# EAGLE design SparkFun_Buck-Boost (EAGLE 9.6.2)
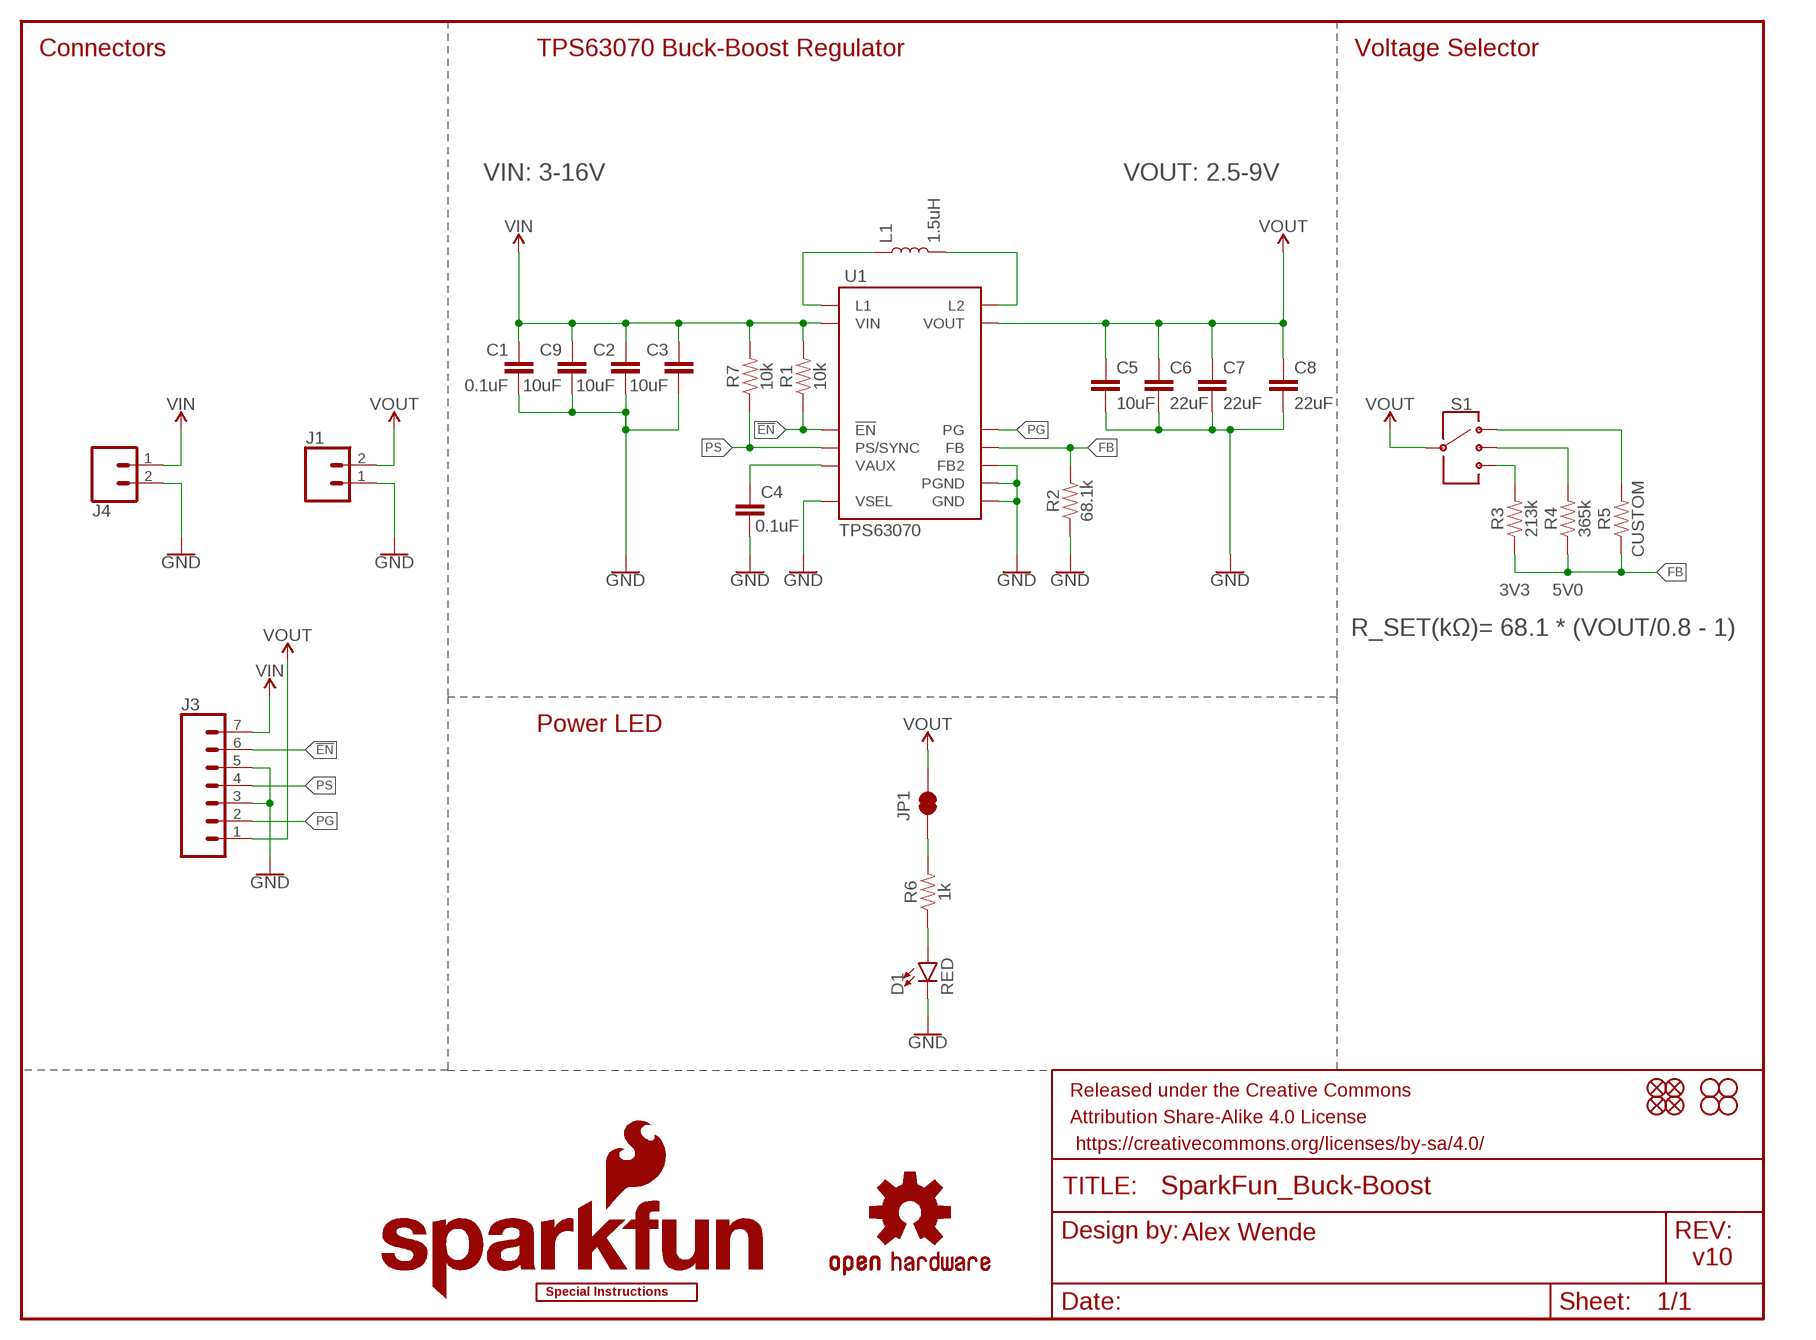
[diagram p0: schematic, sheet 1]

## Parts
C1  0.1uF  0.1UF-0603-25V-(+80/-20%)  [0603]
C2  10uF  10UF-0805-25V-10%  [0805]
C3  10uF  10UF-0805-25V-10%  [0805]
C4  0.1uF  0.1UF-0603-25V-(+80/-20%)  [0603]
C5  10uF  10UF-0805-25V-10%  [0805]
C6  22uF  22UF-0805-16V-20%  [0805]
C7  22uF  22UF-0805-16V-20%  [0805]
C8  22uF  22UF-0805-16V-20%  [0805]
C9  10uF  10UF-0805-25V-10%  [0805]
D1  RED  LED-RED0603  [LED-0603]
FD1  FIDUCIALUFIDUCIAL  [FIDUCIAL-MICRO]
FD2  FIDUCIALUFIDUCIAL  [FIDUCIAL-MICRO]
FD3  FIDUCIALUFIDUCIAL  [FIDUCIAL-MICRO]
FD4  FIDUCIALUFIDUCIAL  [FIDUCIAL-MICRO]
FRAME1  FRAME-LETTER  [CREATIVE_COMMONS]
H1  STAND-OFF  [STAND-OFF]
H2  STAND-OFF  [STAND-OFF]
H3  STAND-OFF  [STAND-OFF]
H4  STAND-OFF  [STAND-OFF]
J1  CONN_023.5MM-NO_SILK  [SCREWTERMINAL-3.5MM-2-NS]
J3  CONN_07NO_SILK  [1X07_NO_SILK]
J4  CONN_023.5MM-NO_SILK  [SCREWTERMINAL-3.5MM-2-NS]
JP1  JUMPER-SMT_2_NC_TRACE_NO-SILK  [SMT-JUMPER_2_NC_TRACE_NO-SILK]
L1  1.5uH  INDUCTOR-XFL40201.5UH  [XFL4020]
LOGO1  SFE_LOGO_NAME_FLAME.1_INCH  [SFE_LOGO_NAME_FLAME_.1]
LOGO2  OSHW-LOGOS  [OSHW-LOGO-S]
LOGO3  SPECIAL_INSTRUCTIONS-ORDERING  [ORDERING_INSTRUCTIONS]
R1  10k  10KOHM-0603-1/10W-1%  [0603]
R2  68.1k  68.1KOHM-0603-1/10W-1%  [0603]
R3  213k  213KOHM-0603-1/10W-0.1%  [0603]
R4  365k  365KOHM-0603-1/10W-1%  [0603]
R5  CUSTOM  RESISTORAXIAL-0.3  [AXIAL-0.3]
R6  1k  1KOHM-0603-1/10W-1%  [0603]
R7  10k  10KOHM-0603-1/10W-1%  [0603]
S1  SWITCH-SP3T-SMD  [SWITCH_SP3T_SMD]
U1  TPS63070  [VQFN-15-HR(3X2.5)]

## Nets
!EN: J3.6 R1.1 U1.P$14(!EN)
FB: R2.2 R3.1 R4.1 R5.P$1 U1.P$5(FB)
GND: C1.2 C2.2 C3.2 C4.2 C5.2 C6.2 C7.2 C8.2 C9.2 D1.C J1.1 J3.3 J3.5 J4.2 R2.1 U1.P$4(GND) U1.P$6(FB2) U1.P$10(PGND) U1.P$15(VSEL)
N$1: L1.P$1 U1.P$11(L1)
N$2: L1.P$2 U1.P$9(L2)
N$4: R5.P$2 S1.1
N$5: R4.2 S1.2
N$6: C4.1 U1.P$3(VAUX)
N$7: R3.2 S1.4
N$8: JP1.1 R6.2
N$9: D1.A R6.1
PG: J3.2 U1.P$2(PG)
PS: J3.4 R7.1 U1.P$1(PS/SYNC)
VIN: C1.1 C2.1 C3.1 C9.1 J3.7 J4.1 R1.2 R7.2 U1.P$12/13(VIN)
VOUT: C5.1 C6.1 C7.1 C8.1 J1.2 J3.1 JP1.2 S1.3 U1.P$7/8(VOUT)

## Notes on the sheet
- Connectors | TPS63070 Buck-Boost Regulator | Voltage Selector
- VIN: 3-16V | VOUT: 2.5-9V
- 3V3 | 5V0
- R_SET(kΩ)= 68.1 * (VOUT/0.8 - 1)
- Power LED
- Alex Wende
- v10

## Library data of the parts
C1 C4 = SparkFun-Capacitors:0.1UF: 0.1µF ceramic capacitors A capacitor is a passive two-terminal electrical component used to store electrical energy temporarily in an electric field.; PROD_ID: CAP-00810
C2 C3 C5 C9 = SparkFun-Capacitors:10UF: 10.0µF ceramic capacitors A capacitor is a passive two-terminal electrical component used to store electrical energy temporarily in an electric field.; PROD_ID: CAP-14259
C6-C8 = SparkFun-Capacitors:22UF: 22µF ceramic capacitors A capacitor is a passive two-terminal electrical component used to store electrical energy temporarily in an electric field.; PROD_ID: CAP-14260
D1 = SparkFun-LED:LED-RED: Red SMD LED Used in manufacturing of most products at SparkFun Packages: 0603 - SMD 0603 package [Product Link] <http://docs.avagotech.com/docs/AV02-0551EN> 0603 SMART - SMD 0603 SMART package ( more efficient and expensive)[Product Link] <http://www.osram-os.com/Graphics/XPic2/00077099_0.pdf> 1206 - SMD1206 package [Product Link] <https://www.sparkfun.com/datasheets/DevTools/LilyPad/Q150OVS4.pdff> SparkFun Products: Pro Mini 328 -5V <https://www.sparkfun.com/products/821> RedBoard <https://www.sparkfun.com/products/12757> IOIO-OTG <https://www.sparkfun.com/products/13613>; PROD_ID: DIO-00819
FD1-FD4 = SparkFun-Aesthetics:FIDUCIAL: Fiducial Alignment Points Point-of-reference for pick-and-place machines and other optical instruments.
FRAME1 = SparkFun-Aesthetics:FRAME-LETTER: Schematic Frame - Letter Standard 8.5x11 US Letter frame
H1-H4 = SparkFun-Hardware:STAND-OFF: Stand Off Drill holes for mechanically mounting via screws, standoffs, etc. Note: Use the keepout ring to avoid running the screw head into surrounding components. Variant Overviews STAND-OFF - Mechanical footprint for a #4 phillips button head screw. STAND-OFF-TIGHT - Mechanical footprint for a #4 phillips button head screw, Example SparkFun Products Screw - Phillips Head (1/4", 4-40, 10 pack) <https://www.sparkfun.com/products/10453> (PRT-10453) Screw - Phillips Head (1/2", 4-40, 10 pack) <https://www.sparkfun.com/products/10452> (PRT-10452) Screw - Phillips Head (3/4", 4-40, 10 pack) <https://www.sparkfun.com/products/10451> (PRT-10451) Screw - Phillips Head (1", 4-40, 10 pack) <https://www.sparkfun.com/products/10450> (PRT-10450)
J1 J4 = SparkFun-Connectors:CONN_02: Multi connection point. Often used as Generic Header-pin footprint for 0.1 inch spaced/style header connections On any of the 0.1 inch spaced packages, you can populate with these: Break Away Headers - Straight <https://www.sparkfun.com/products/116> (PRT-00116) Break Away Male Headers - Right Angle <https://www.sparkfun.com/products/553> (PRT-00553) Female Headers <https://www.sparkfun.com/products/115> (PRT-00115) Break Away Headers - Machine Pin <https://www.sparkfun.com/products/117> (PRT-00117) Break Away Female Headers - Swiss Machine Pin <https://www.sparkfun.com/products/743> (PRT-00743) For SCREWTERMINALS and SPRING TERMINALS visit here: Screw Terimnals on SparkFun.com <https://www.sparkfun.com/search/results?term=Screw+Terminals> (5mm/3.5mm/2.54mm spacing) This device is also useful as a general connection point to wire up your design to another part of your project. Our various solder wires solder well into these plated through hole pads. Hook-Up Wire - Assortment (Stranded, 22 AWG) <https://www.sparkfun.com/products/11375> (PRT-11375) Hook-Up Wire - Assortment (Solid Core, 22 AWG) <https://www.sparkfun.com/products/11367> (PRT-11367) View the entire wire category on our website here <https://www.sparkfun.com/categories/141> Special notes: Molex polarized connector foot print use with: PRT-08233 with associated crimp pins and housings. 2.54_SCREWTERM for use with PRT-10571. 3.5mm Screw Terminal footprints for PRT-08084 5mm Screw Terminal footprints for use with PRT-08432; PROD_ID: CONN-08399
J3 = SparkFun-Connectors:CONN_07: Multi connection point. Often used as Generic Header-pin footprint for 0.1 inch spaced/style header connections On any of the 0.1 inch spaced packages, you can populate with these: Break Away Headers - Straight <https://www.sparkfun.com/products/116> (PRT-00116) Break Away Male Headers - Right Angle <https://www.sparkfun.com/products/553> (PRT-00553) Female Headers <https://www.sparkfun.com/products/115> (PRT-00115) Break Away Headers - Machine Pin <https://www.sparkfun.com/products/117> (PRT-00117) Break Away Female Headers - Swiss Machine Pin <https://www.sparkfun.com/products/743> (PRT-00743) For SCREWTERMINALS and SPRING TERMINALS visit here: Screw Terimnals on SparkFun.com <https://www.sparkfun.com/search/results?term=Screw+Terminals> (5mm/3.5mm/2.54mm spacing) This device is also useful as a general connection point to wire up your design to another part of your project. Our various solder wires solder well into these plated through hole pads. Hook-Up Wire - Assortment (Stranded, 22 AWG) <https://www.sparkfun.com/products/11375> (PRT-11375) Hook-Up Wire - Assortment (Solid Core, 22 AWG) <https://www.sparkfun.com/products/11367> (PRT-11367) View the entire wire category on our website here <https://www.sparkfun.com/categories/141> Special notes: Molex polarized connector foot print use with SKU : PRT-08231 with associated crimp pins and housings. 1MM SMD Version SKU: PRT-10208 NOTES ON THE VARIANTS LOCK and LOCK_LONGPADS... This footprint was designed to help hold the alignment of a through-hole component (i.e. 6-pin header) while soldering it into place. You may notice that each hole has been shifted either up or down by 0.005 of an inch from it's more standard position (which is a perfectly straight line). This slight alteration caused the pins (the squares in the middle) to touch the edges of the holes. Because they are alternating, it causes a "brace" to hold the component in place. 0.005 has proven to be the perfect amount of "off-center" position when using our standard breakaway headers. Although looks a little odd when you look at the bare footprint, once you have a header in there, the alteration is very hard to notice. Also,if you push a header all the way into place, it is covered up entirely on the bottom side.
JP1 = SparkFun-Jumpers:JUMPER-SMT_2_NC_TRACE: Normally closed trace jumper This jumper has a trace between two pads so it's normally closed (NC). Use a razor knife to open the connection. For best results follow the IPC guidelines for cutting traces: Cutout at least 0.063 mm (0.005 in). Remove all loose material to clean up the cut area. Seal the cut with an approved epoxy. Reapply solder to reclose the connection.
L1 = SparkFun-Coils:INDUCTOR-XFL4020; PROD_ID: INDUC-13855
LOGO1 = SparkFun-Aesthetics:SFE_LOGO_NAME_FLAME: SparkFun Font Logo w/ Flame This is the SparkFun full logo. The logo on the schematic will always be the same size; the package variant is the height of the flame part of the logo. Default layer for the logo on the board is tSilk.
LOGO2 = SparkFun-Aesthetics:OSHW-LOGO: Open-Source Hardware (OSHW) Logo This logo indicates the piece of hardware it is found on incorporates a OSHW license and/or adheres to the definition of open source hardware found here: http://freedomdefined.org/OSHW
LOGO3 = SparkFun-Aesthetics:SPECIAL_INSTRUCTIONS: Special Ordering/Production Instructions Alert Symbol for special PCB ordering instructions or unique production process warnings. Ordering Instructions Production Instructions Types of information that should be added to box: Copper weight Soldermask color Silk color PCB thickness Number of layers PCB Standard: 1.6mm FR4 1 oz copper immersion silver plating red soldermask white silkscreen Types of information that should be added to box: Special wash requirements Depaneling instructions Humidification Glue curing Default text settings: 0.07 inch 9% ratio 50% line distance
R1 R7 = SparkFun-Resistors:10KOHM: 10kΩ resistor A resistor is a passive two-terminal electrical component that implements electrical resistance as a circuit element. Resistors act to reduce current flow, and, at the same time, act to lower voltage levels within circuits. - Wikipedia; PROD_ID: RES-00824
R2 = SparkFun-Resistors:68.1KOHM: 68.1kΩ resistor A resistor is a passive two-terminal electrical component that implements electrical resistance as a circuit element. Resistors act to reduce current flow, and, at the same time, act to lower voltage levels within circuits. - Wikipedia; PROD_ID: RES-09380
R3 = SparkFun-Resistors:213KOHM; PROD_ID: RES-14261
R4 = SparkFun-Resistors:365KOHM; PROD_ID: RES-14262
R5 = SparkFun-Resistors:RESISTOR: Generic Resistor Package
R6 = SparkFun-Resistors:1KOHM: 1kΩ resistor A resistor is a passive two-terminal electrical component that implements electrical resistance as a circuit element. Resistors act to reduce current flow, and, at the same time, act to lower voltage levels within circuits. - Wikipedia; PROD_ID: RES-07856
S1 = SparkFun-Switches:SWITCH-SP3T: Single-Pole, Triple-Throw (SP3T) Switch Single-Pole, Triple-Throw switches SparkFun Products Prototype Part; PROD_ID: SWCH-10805
U1 = SparkFun-IC-Power:TPS63070; PROD_ID: IC-14258

## Board
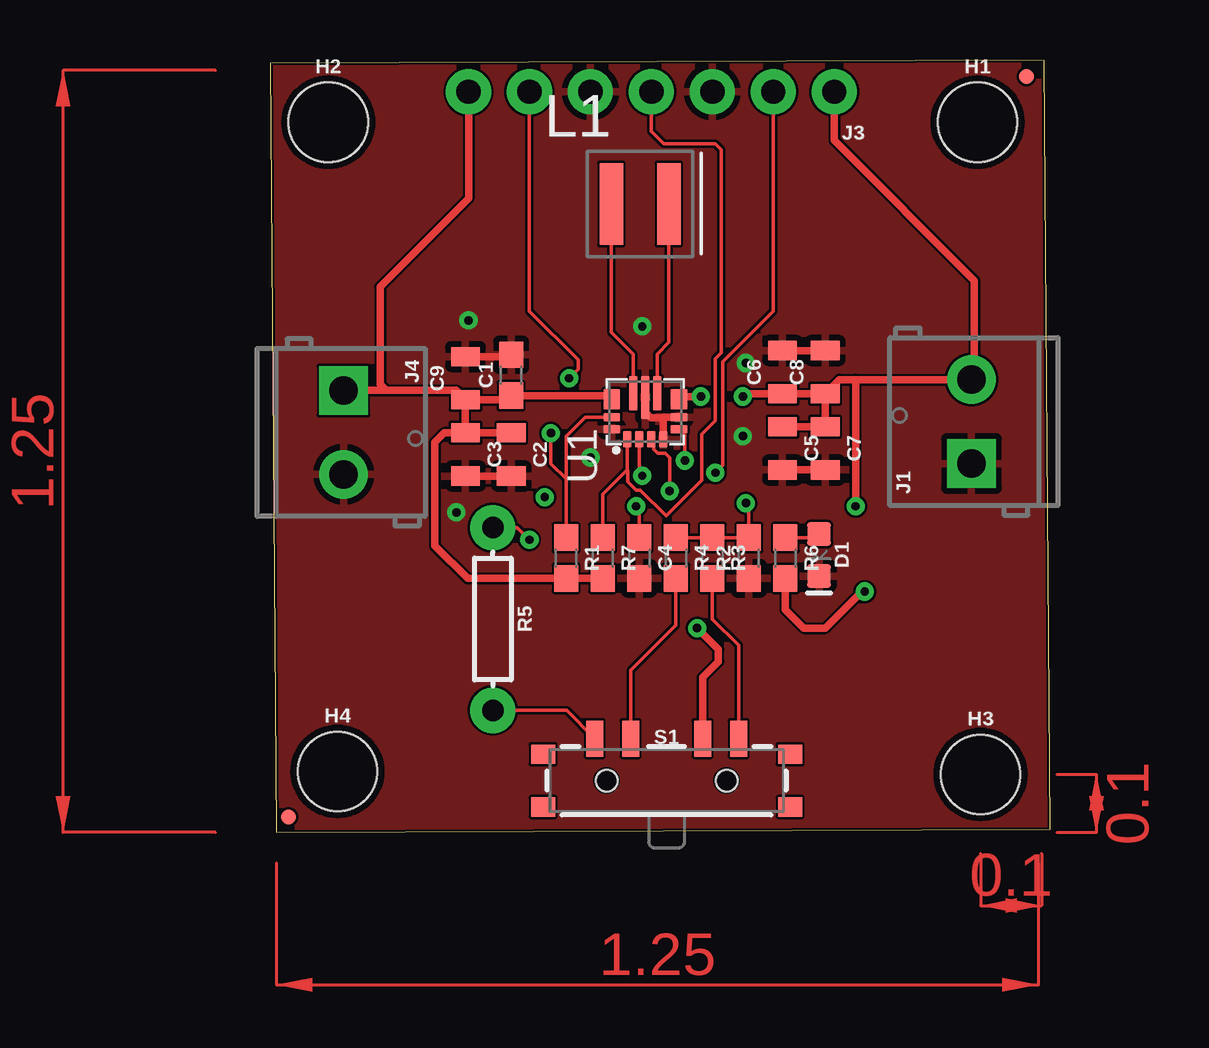
[diagram p1: board, top side]
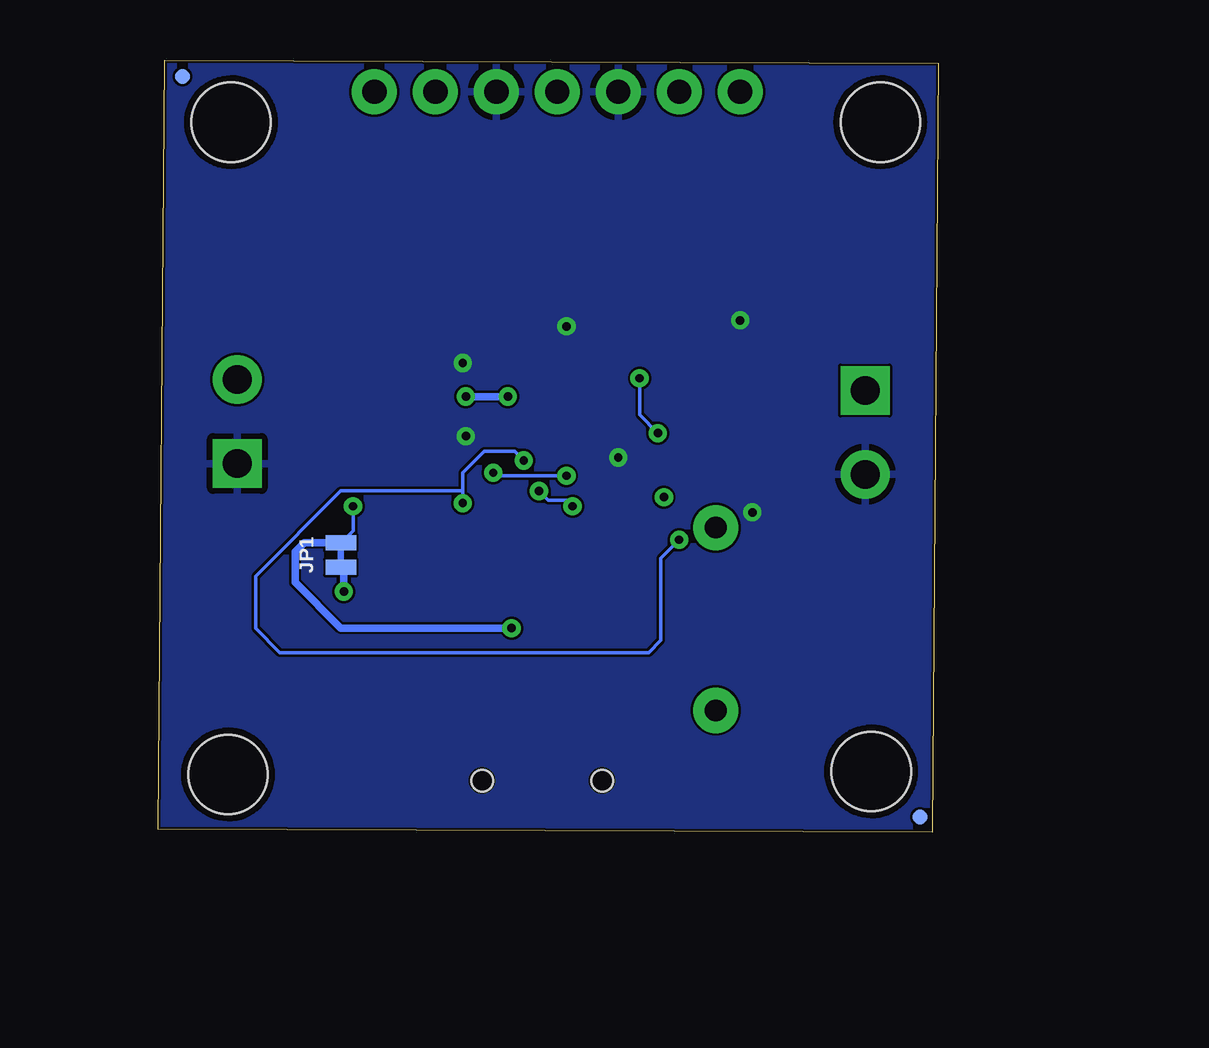
[diagram p2: board, bottom side, seen from below]

Size 32.49 x 32.18 mm. Coordinates in mm from the lower left corner, seen from the top.
Outline: 0.25,0 32.49,0.13 32.24,32.18 0,32.05 0.25,0
Copper layers (1*16): Top 0.035mm / dielectric 1.5mm / Bottom 0.035mm
Design rules "default *": minimum track width 6mil, minimum drill 0.35mm, track to track 4mil, track to pad 4mil, pad to pad 4mil, via to via 4mil, smd to smd 4mil, copper to edge 4mil, drill to drill 4mil, minimum pad ring 10mil, minimum via ring 8mil, stop-mask expansion 4mil, vias tented up to drill 0mil, thermal gap 10mil

### Footprints (pad centres in the part's own frame; a part is rotated, then mirrored left to right if it is on the bottom)
0603 = smd 1.1 x 1: 1 -0.85,0; 2 0.85,0
0805 = smd 0.8 x 1.2: 1 -0.9,0; 2 0.9,0
LED-0603 = smd 1 x 1: A -0.877,0; C 0.877,0
FIDUCIAL-MICRO = smd 0.635 x 0.635: 1 0,0
STAND-OFF = hole 3.302: 0,0
SCREWTERMINAL-3.5MM-2-NS = drill 1.2 pad 2.032 square: 1 0,0 | drill 1.2 pad 2.032: 2 3.5,0
1X07_NO_SILK = drill 1.016 pad 1.88: 1 0,0; 2 2.54,0; 3 5.08,0; 4 7.62,0; 5 10.16,0; 6 12.7,0; 7 15.24,0
SMT-JUMPER_2_NC_TRACE_NO-SILK = smd 0.635 x 1.27: 1 -0.508,0; 2 0.508,0
XFL4020 = smd 0.98 x 3.4: P$1 1,1.8; P$2 3.4,1.8
AXIAL-0.3 = drill 0.9 pad 1.88: P$1 -3.81,0; P$2 3.81,0
SWITCH_SP3T_SMD = smd 0.7 x 1.5: 1 3,-1.75; 2 1.5,-1.75; 3 -1.5,-1.75; 4 -3,-1.75 | smd 1 x 0.8: P$1 -5.15,-1.1; P$2 -5.15,1.1; P$3 5.15,1.1; P$4 5.15,-1.1 | hole 0.9: 2.5,0; -2.5,0
VQFN-15-HR(3X2.5) = smd 0.7 x 0.35: P$1 -1.15,0.75; P$2 -1.15,0.25; P$3 -1.15,-0.25; P$4 -1.15,-0.75 | smd 0.35 x 0.7: P$5 -0.725,-1.4; P$6 -0.225,-1.4; P$14 -0.225,1.4; P$15 -0.725,1.4 | smd 0.85 x 0.7: P$7/8 0.525,-1.4; P$12/13 0.525,1.4 | smd 1.45 x 0.35: P$9 0.775,-0.5; P$11 0.775,0.5 | smd 1.8 x 0.35: P$10 0.6,0

### Placement (x,y rotation side)
C1  10.03,19.05 90 top
C2  10.03,15.75 270 top
C3  8.13,15.75 270 top
C4  15.37,11.43 270 top
C5  21.34,16 270 top
C6  21.34,19.18 90 top
C7  23.11,16 270 top
C8  23.11,19.18 90 top
C9  8.13,18.92 90 top
D1  22.86,11.56 270 top
FD1  31.5,31.5 0 top
FD2  0.76,0.64 0 top
FD3  0.76,0.64 0 bottom
FD4  31.5,31.5 0 bottom
FRAME1  -79.76,66.04 0 top  (outside the outline)
H1  29.46,29.59 0 top
H2  2.41,29.59 0 top
H3  29.59,2.41 0 top
H4  2.79,2.54 0 top
J1  29.21,15.37 90 top
J3  23.5,30.86 180 top
J4  3.05,18.41 270 top
JP1  24.89,11.56 90 bottom
L1  13.21,24.38 0 top
LOGO1  -83.57,76.2 0 top  (outside the outline)
LOGO2  -26.42,87.63 0 top  (outside the outline)
LOGO3  -115.32,52.07 0 top  (outside the outline)
R1  12.32,11.43 270 top
R2  19.94,11.43 90 top
R3  18.42,11.43 270 top
R4  16.89,11.43 270 top
R5  9.27,8.89 270 top
R6  21.46,11.43 270 top
R7  13.84,11.43 270 top
S1  16.51,2.16 180 top
U1  15.62,17.53 90 top

### Tracks (layer width: path | path; a pad name or v marks a point on that pad's centre or on a via)
!EN  (via drill 0.35)
  Top 0.152: R1.1 12.32,14.73 | 12.32,14.73 12.32,16.51 13.11,17.3 U1.P$14 | J3.6 10.79,21.72 12.83,19.68 12.83,19.3 v12.45,18.92 | v11.68,16.64 11.68,15.37 12.32,14.73
  Bottom 0.152: v12.45,18.92 12.45,17.4 v11.68,16.64
FB  (via drill 0.35)
  Top 0.152: R4.1 R3.1 R2.2 19.94,13.59 v19.81,13.72 | U1.P$5 17.27,16.55 v17.27,15.49 | R5.P$1 10.29,12.7 v10.79,12.19
  Bottom 0.152: v17.27,15.49 17.65,15.88 18.92,15.88 19.81,14.99 19.81,14.22 | 19.81,14.22 v19.81,13.72 | v10.79,12.19 11.56,11.43 11.56,8 12.06,7.49 27.43,7.49 28.45,8.51 28.45,10.67 24.89,14.22 19.81,14.22
GND  (via drill 0.35)
  Top 0.305: C3.2 C2.2 | C5.2 C7.2 | C9.2 9.96,19.82 C1.2 | U1.P$10 15.64,18.11 15.64,17.48 15.85,17.27 16.26,17.27 | 16.26,17.27 16.39,17.27 16.42,17.3 U1.P$6 | U1.P$4 16.37,16.53 16.37,17.16 16.26,17.27 | C6.2 C8.2
  other vias: 13.33,15.62 15.49,21.08 7.75,13.34 8.25,21.34 19.81,19.56 19.69,16.51
  pour Top: -2.16,33.66 -2.16,0.89 2.54,-3.81 30.35,-3.81 30.61,-4.06 35.43,0.76 35.43,2.03 35.43,32.51 32.13,35.81 30.86,37.08 0.64,37.08 -2.16,34.29
  pour Bottom: 0.76,39.37 31.5,39.37 39.5,31.37 39.5,-2.54 32.64,-9.4 2.67,-9.4 2.54,-9.27 -5.33,-1.4 -5.33,-0.76 -5.33,33.27
N$1
  Top 0.152: L1.P$1 14.21,20.84 15.12,19.93 U1.P$11
N$2
  Top 0.152: L1.P$2 16.61,20.42 16.12,19.93 U1.P$9
N$4
  Top 0.152: R5.P$2 12.34,5.08 S1.1
N$5
  Top 0.152: R4.2 16.89,8.64 15.01,6.75 S1.2
N$6  (via drill 0.35)
  Top 0.152: v16.64,14.22 16.64,15.61 16.45,15.8 16.13,15.8 15.97,15.96 15.97,16.28 U1.P$3 | v15.24,13.59 15.37,13.46 C4.1
  Bottom 0.152: v16.64,14.22 16.26,13.84 15.37,13.84 15.24,13.72 v15.24,13.59
N$7
  Top 0.152: S1.4 19.51,7.79 18.42,8.89 R3.2
N$8  (via drill 0.35)
  Top 0.305: 21.59,10.45 R6.2 21.46,9.27 22.23,8.51 23.11,8.51 24.64,10.03 v24.77,10.03
  Bottom 0.305: v24.77,10.03 24.77,10.92 JP1.1
N$9
  Top 0.152: D1.A 22.71,12.28 R6.1
N$10  (via drill 0.35)
  other vias: 11.43,13.97
PG  (via drill 0.35)
  Top 0.152: J3.2 20.96,21.72 18.85,19.61 18.85,15.29 v18.54,14.99 | v15.49,14.86 15.37,14.98 U1.P$2
  Bottom 0.152: v18.54,14.99 18.42,14.86 v15.49,14.86
PS
  Top 0.152: J3.4 15.88,29.21 16.38,28.7 18.54,28.7 18.8,28.45 18.8,19.99 18.54,19.73 18.54,17.15 17.98,16.59 17.98,14.68 16.49,13.18 15.42,14.25 15.24,14.25 14.89,14.61 14.89,15.09 14.86,15.11 | 14.86,15.11 14.86,16.36 U1.P$1 | R7.1 13.84,14.1 14.86,15.11
VIN
  Top 0.305: R7.2 R1.2 8.22,10.58 6.86,11.94 6.86,16.26 7.25,16.65 C3.1 | C9.1 9.86,18.02 C1.1 14.07,18.2 U1.P$12/13 | C3.1 C2.1 | C3.1 C9.1 | J4.1 4.83,18.41 | 4.83,18.41 7.74,18.41 C9.1 | J3.7 8.25,26.42 4.57,22.73 4.57,18.67 4.83,18.41
VOUT  (via drill 0.35)
  Top 0.305: C5.1 C7.1 C8.1 | C8.1 C6.1 19.8,18.28 v19.69,18.16 | C8.1 23.7,18.87 24.38,18.87 | 24.38,18.87 J1.2 29.34,18.99 29.34,22.99 23.5,28.83 J3.1 | S1.3 18.01,6.45 18.67,7.11 18.67,7.62 v17.78,8.51 | U1.P$7/8 17.13,18.16 v17.94,18.16 17.98,18.16 | v24.38,13.59 24.38,18.87
  Bottom 0.152: JP1.2 24.38,12.57 v24.38,13.59
  Bottom 0.305: JP1.2 26.42,12.06 26.8,11.68 26.8,10.41 24.89,8.51 v17.78,8.51 | v17.94,18.16 v19.69,18.16
(copper drawn outside any net)
  shapes: Top area x4